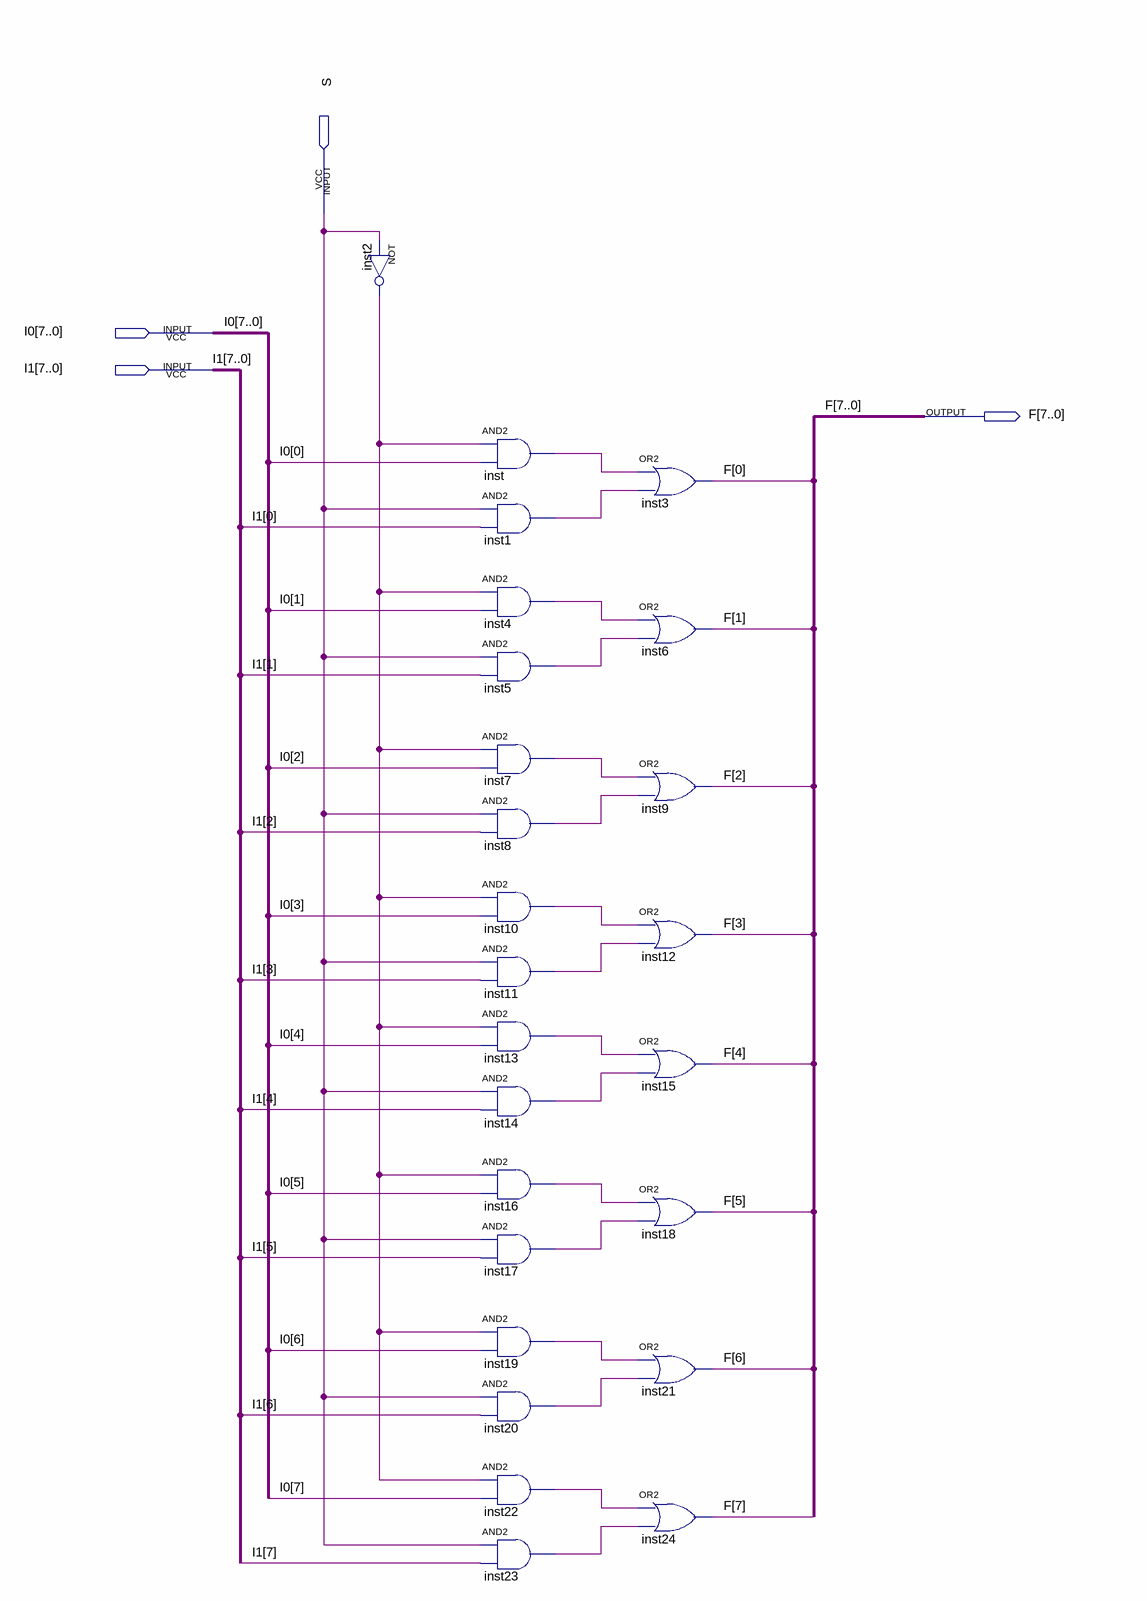
[diagram p0: schematic sheet]
// Quartus schematic 8Bit_2to1Mux.bdf as structural Verilog: 25 symbols, 4 pins
module \8Bit_2to1Mux  (
  input  S,
  input  [7:0] I0,
  input  [7:0] I1,
  output [7:0] F
);

  wire inst1_out, inst2_out, inst4_out, inst5_out, inst7_out, inst8_out, inst10_out, inst11_out, inst13_out,
       inst14_out, inst16_out, inst17_out, inst19_out, inst20_out, inst22_out, inst23_out, inst_out;

  not inst2 (inst2_out, S);
  and inst (inst_out, inst2_out, I0[0]);
  and inst1 (inst1_out, S, I1[0]);
  and inst4 (inst4_out, inst2_out, I0[1]);
  and inst5 (inst5_out, S, I1[1]);
  and inst7 (inst7_out, inst2_out, I0[2]);
  and inst8 (inst8_out, S, I1[2]);
  and inst10 (inst10_out, inst2_out, I0[3]);
  and inst11 (inst11_out, S, I1[3]);
  and inst13 (inst13_out, inst2_out, I0[4]);
  and inst14 (inst14_out, S, I1[4]);
  and inst16 (inst16_out, inst2_out, I0[5]);
  and inst17 (inst17_out, S, I1[5]);
  and inst19 (inst19_out, inst2_out, I0[6]);
  and inst20 (inst20_out, S, I1[6]);
  and inst22 (inst22_out, inst2_out, I0[7]);
  and inst23 (inst23_out, S, I1[7]);
  or inst3 (F[0], inst_out, inst1_out);
  or inst6 (F[1], inst4_out, inst5_out);
  or inst9 (F[2], inst7_out, inst8_out);
  or inst12 (F[3], inst10_out, inst11_out);
  or inst15 (F[4], inst13_out, inst14_out);
  or inst18 (F[5], inst16_out, inst17_out);
  or inst21 (F[6], inst19_out, inst20_out);
  or inst24 (F[7], inst22_out, inst23_out);
endmodule
